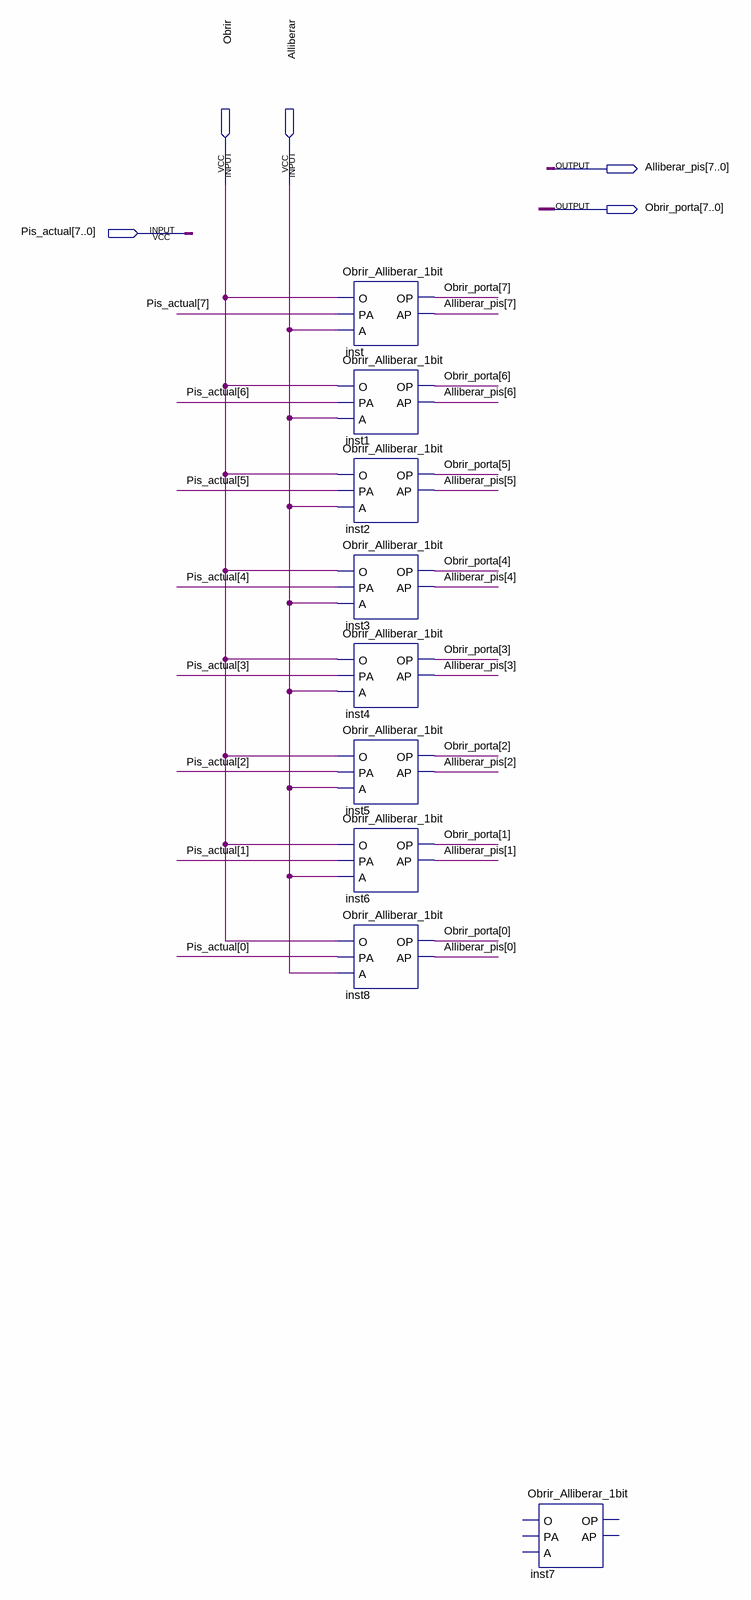
[diagram p0: schematic sheet]
// Quartus schematic Obrir_Alliberar.bdf as structural Verilog: 9 symbols, 5 pins
module Obrir_Alliberar (
  input  Obrir,
  input  Alliberar,
  input  [7:0] Pis_actual,
  output [7:0] Alliberar_pis,
  output [7:0] Obrir_porta
);

  Obrir_Alliberar_1bit inst (.O(Obrir), .PA(Pis_actual[7]), .A(Alliberar), .OP(Obrir_porta[7]), .AP(Alliberar_pis[7]));
  Obrir_Alliberar_1bit inst1 (.O(Obrir), .PA(Pis_actual[6]), .A(Alliberar), .OP(Obrir_porta[6]), .AP(Alliberar_pis[6]));
  Obrir_Alliberar_1bit inst2 (.O(Obrir), .PA(Pis_actual[5]), .A(Alliberar), .OP(Obrir_porta[5]), .AP(Alliberar_pis[5]));
  Obrir_Alliberar_1bit inst3 (.O(Obrir), .PA(Pis_actual[4]), .A(Alliberar), .OP(Obrir_porta[4]), .AP(Alliberar_pis[4]));
  Obrir_Alliberar_1bit inst4 (.O(Obrir), .PA(Pis_actual[3]), .A(Alliberar), .OP(Obrir_porta[3]), .AP(Alliberar_pis[3]));
  Obrir_Alliberar_1bit inst5 (.O(Obrir), .PA(Pis_actual[2]), .A(Alliberar), .OP(Obrir_porta[2]), .AP(Alliberar_pis[2]));
  Obrir_Alliberar_1bit inst6 (.O(Obrir), .PA(Pis_actual[1]), .A(Alliberar), .OP(Obrir_porta[1]), .AP(Alliberar_pis[1]));
  Obrir_Alliberar_1bit inst8 (.O(Obrir), .PA(Pis_actual[0]), .A(Alliberar), .OP(Obrir_porta[0]), .AP(Alliberar_pis[0]));
  Obrir_Alliberar_1bit inst7 ();  // open: O, PA, A, OP, AP
endmodule
